# EAGLE schematic CarteMere_V1 (EAGLE 8.4.0)
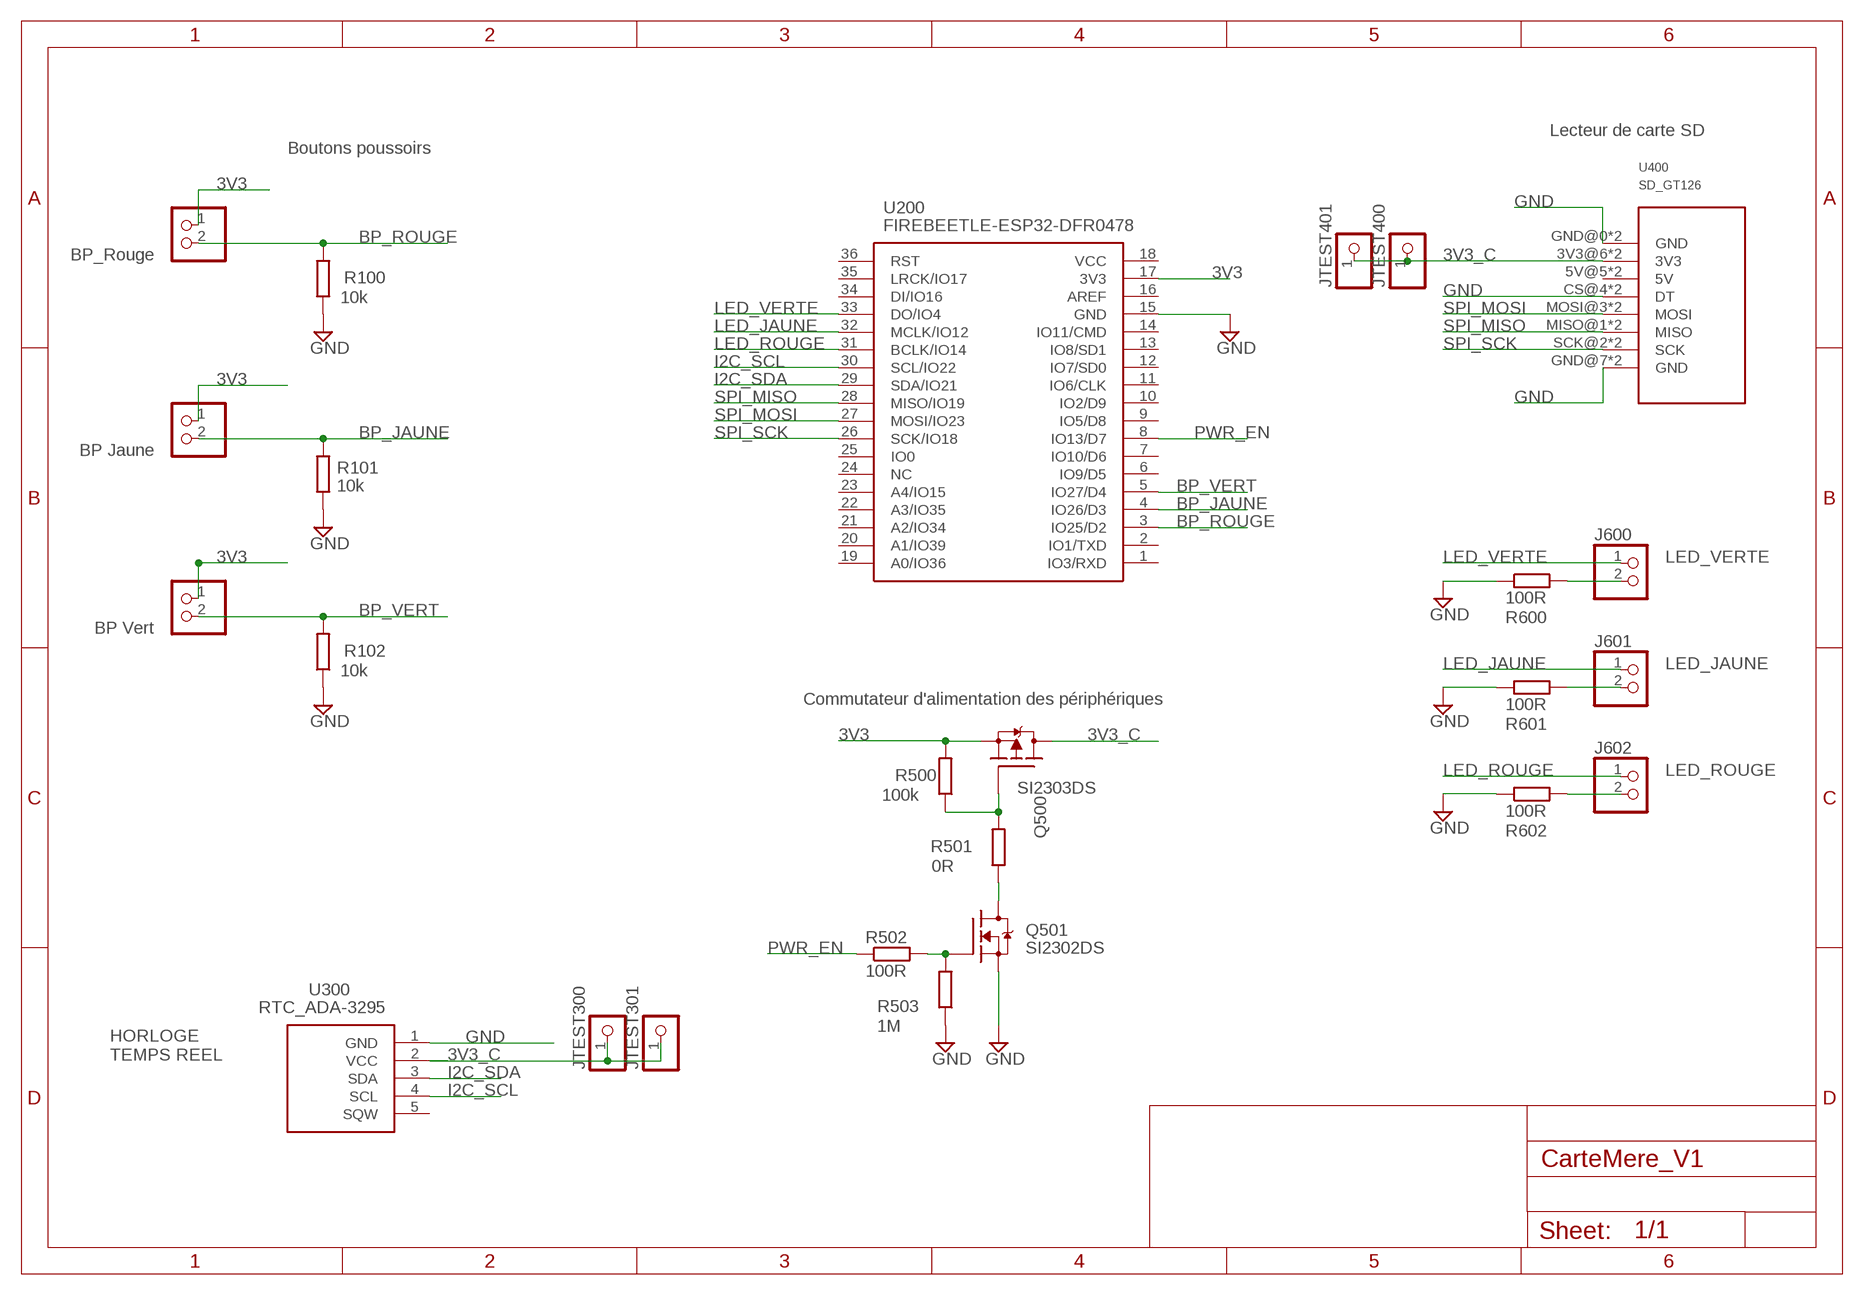
[diagram p0: schematic, sheet 1]
FRAME1 (A4L-LOC): SPICEPREFIX: X

## Parts
J100  BP_Rouge  PINHD-1X2  [1X02]
J101  BP Jaune  PINHD-1X2  [1X02]
J102  BP Vert  PINHD-1X2  [1X02]
J600  LED_VERTE  PINHD-1X2  [1X02]
J601  LED_JAUNE  PINHD-1X2  [1X02]
J602  LED_ROUGE  PINHD-1X2  [1X02]
JTEST300  PINHD-1X1  [1X01]
JTEST301  PINHD-1X1  [1X01]
JTEST400  PINHD-1X1  [1X01]
JTEST401  PINHD-1X1  [1X01]
Q500  SI2303DS  [SOT23]
Q501  SI2302DS  [SOT23]
R100  10k  R_1/4W10  [0207/10]
R101  10k  R_1/4W10  [0207/10]
R102  10k  R_1/4W10  [0207/10]
R500  100k  R_1/4W10  [0207/10]
R501  0R  R_1/4W10  [0207/10]
R502  100R  R_1/4W10  [0207/10]
R503  1M  R_1/4W10  [0207/10]
R600  100R  R_1/4W10  [0207/10]
R601  100R  R_1/4W10  [0207/10]
R602  100R  R_1/4W10  [0207/10]
U200  FIREBEETLE-ESP32-DFR0478  [FIREBEETLE_ESP32]
U300  RTC_ADA-3295  [ADA3295]
U400  SD_GT126  [SD_GT126]

## Nets
3V3: J100.1 J101.1 J102.1 Q500.2(S) R500.2 U200.17(3V3)
3V3_C: JTEST300.1 JTEST301.1 JTEST400.1 JTEST401.1 Q500.3(D) U300.2(VCC) U400.3V3@6(3V3) U400.3V3@9(3V3)
BP_JAUNE: J101.2 R101.2 U200.4(IO26/D3)
BP_ROUGE: J100.2 R100.2 U200.3(IO25/D2)
BP_VERT: J102.2 R102.2 U200.5(IO27/D4)
DQ501: Q501.3(D) R501.1
GND: Q501.2(S) R100.1 R101.1 R102.1 R503.1 R600.1 R601.1 R602.1 U200.15(GND) U300.1(GND) U400.CS@4(DT) U400.CS@11(DT) U400.GND@0(GND) U400.GND@7(GND) U400.GND@8(GND) U400.GND@15(GND)
I2C_SCL: U200.30(SCL/IO22) U300.4(SCL)
I2C_SDA: U200.29(SDA/IO21) U300.3(SDA)
LED_JAUNE: J601.1 U200.32(MCLK/IO12)
LED_ROUGE: J602.1 U200.31(BCLK/IO14)
LED_VERTE: J600.1 U200.33(DO/IO4)
N$1: Q501.1(G) R502.2 R503.2
N$2: J600.2 R600.2
N$3: J601.2 R601.2
N$4: J602.2 R602.2
N$7: Q500.1(G) R500.1 R501.2
PWR_EN: R502.1 U200.8(IO13/D7)
SPI_MISO: U200.28(MISO/IO19) U400.MISO@1(MISO) U400.MISO@14(MISO)
SPI_MOSI: U200.27(MOSI/IO23) U400.MOSI@3(MOSI) U400.MOSI@12(MOSI)
SPI_SCK: U200.26(SCK/IO18) U400.SCK@2(SCK) U400.SCK@13(SCK)
Unconnected: U200.1(IO3/RXD) U200.2(IO1/TXD) U200.6(IO9/D5) U200.7(IO10/D6) U200.9(IO5/D8) U200.10(IO2/D9) U200.11(IO6/CLK) U200.12(IO7/SD0) U200.13(IO8/SD1) U200.14(IO11/CMD) U200.16(AREF) U200.18(VCC) U200.19(A0/IO36) U200.20(A1/IO39) U200.21(A2/IO34) U200.22(A3/IO35) U200.23(A4/IO15) U200.24(NC) U200.25(IO0) U200.34(DI/IO16) U200.35(LRCK/IO17) U200.36(RST) U300.5(SQW) U400.5V@5(5V) U400.5V@10(5V)

## Notes on the sheet
- Lecteur de carte SD
- Boutons poussoirs
- Commutateur d'alimentation des périphériques
- HORLOGE
  TEMPS REEL

## Library data of the parts
J100-J102 J600-J602 = pinhead:PINHD-1X2: PIN HEADER
JTEST300 JTEST301 JTEST400 JTEST401 = pinhead:PINHD-1X1: PIN HEADER
Q500 = Eagle_UOF_Lib:SI2303DS: MOSFET Canal P
Q501 = Eagle_UOF_Lib:SI2302DS
R100-R102 R500-R503 R600-R602 = Eagle_UOF_Lib:R_1/4W
U200 = Eagle_UOF_Lib:FIREBEETLE-ESP32-DFR0478: Development Boards & Kits - Wireless FireBeetle ESP32 IOT MCU Source: Datasheet <https://github.com/Robert-MARKII/Document/blob/master/FireBeetle Board-ESP32 User Manual update.pdf>; DESCRIPTION: Development Boards & Kits - Wireless FireBeetle ESP32 IOT MCU; HEIGHT: mm; MANUFACTURER_NAME: DFRobot; MANUFACTURER_PART_NUMBER: DFR0478; MOUSER_PART_NUMBER: 426-DFR0478; MOUSER_PRICE-STOCK: https://www.mouser.co.uk/ProductDetail/DFRobot/DFR0478?qs=EU6FO9ffTwc%252BR65h2NUGQw%3D%3D
U300 = Eagle_UOF_Lib:RTC_ADA-3295: Real Time Clock module Source: Datasheet <https://learn.adafruit.com/adafruit-pcf8523-real-time-clock/downloads>; DESCRIPTION: Real Time Clock module; HEIGHT: 3.5mm; MANUFACTURER_NAME: Adafruit; MANUFACTURER_PART_NUMBER: ADA-3295
U400 = Eagle_UOF_Lib:SD_GT126